# EAGLE schematic IMU_BNO085_Schematic (EAGLE 9.6.2)
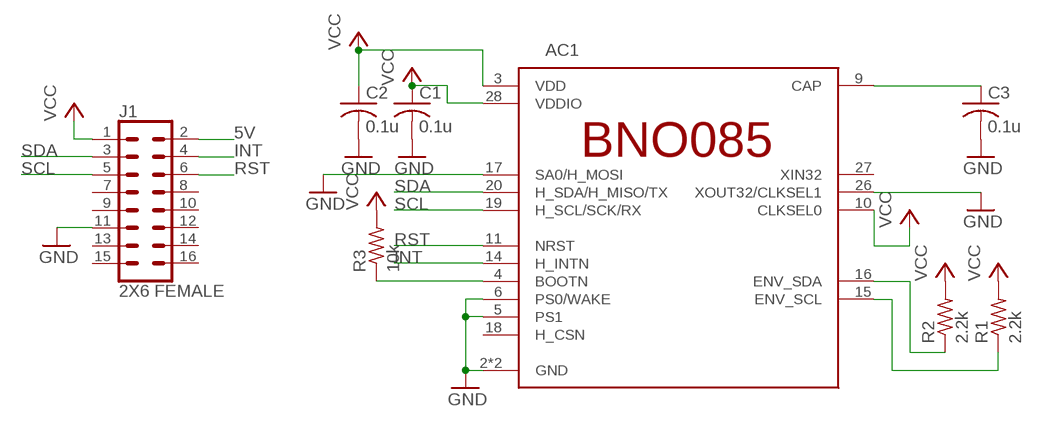
[diagram p0: schematic, sheet 1]

## Parts
AC1  BNO085  [BNO085]
C1  0.1u  C-ALL_PACKAGESC1206  [C1206]
C2  0.1u  C-ALL_PACKAGESC1206  [C1206]
C3  0.1u  C-ALL_PACKAGESC1206  [C1206]
J1  2X6 FEMALE  SENSOR_BREAKOUTPTH_FEMALE  [2X7]
R1  2.2k  R-ALL_PACKAGESR1206  [R1206]
R2  2.2k  R-ALL_PACKAGESR1206  [R1206]
R3  10k  R-ALL_PACKAGESR1206  [R1206]

## Nets
5V [PWR]: J1.2
GND [GND]: AC1.2(GND) AC1.5(PS1) AC1.6(PS0/WAKE) AC1.17(SA0/H_MOSI) AC1.25(GND) AC1.26(XOUT32/CLKSEL1) C1.2 C2.2 C3.2 J1.11
INT: AC1.14(H_INTN) J1.4
N$1: AC1.16(ENV_SDA) R2.1
N$2: AC1.15(ENV_SCL) R1.1
N$3: AC1.9(CAP) C3.1
N$8: AC1.4(BOOTN) R3.1
RST: AC1.11(NRST) J1.6
SCL: AC1.19(H_SCL/SCK/RX) J1.5
SDA: AC1.20(H_SDA/H_MISO/TX) J1.3
VCC [PWR]: AC1.3(VDD) AC1.10(CLKSEL0) AC1.28(VDDIO) C1.1 C2.1 J1.1 R1.2 R2.2 R3.2
Unconnected: AC1.18(H_CSN) AC1.27(XIN32) J1.7 J1.8 J1.9 J1.10 J1.12 J1.13 J1.14 J1.15 J1.16

## Library data of the parts
AC1 = BNO085:BNO085: IMU ACCEL/GYRO/MAG I2C 32BIT Source: Datasheet <https://www.hillcrestlabs.com/downloads/bno080-datasheet>; DESCRIPTION: IMU ACCEL/GYRO/MAG I2C 32BIT; HEIGHT: 1.18mm; MANUFACTURER_NAME: Hillcrest Laboratories, Inc.; MANUFACTURER_PART_NUMBER: BNO085
C1-C3 = RTR Main Library:C-ALL_PACKAGES: CAPACITOR, American symbol
J1 = RTR Main Library:SENSOR_BREAKOUT: .1 inch-spaced 12P sensor breakout Used as a generalized connector for attaching new sensors; PROD_ID: CONN-12423
R1-R3 = RTR Main Library:R-ALL_PACKAGES: RESISTOR, American symbol

## Net classes
0 default: width 0.152 mm
1 GND: width 0.254 mm
2 PWR: width 0.254 mm